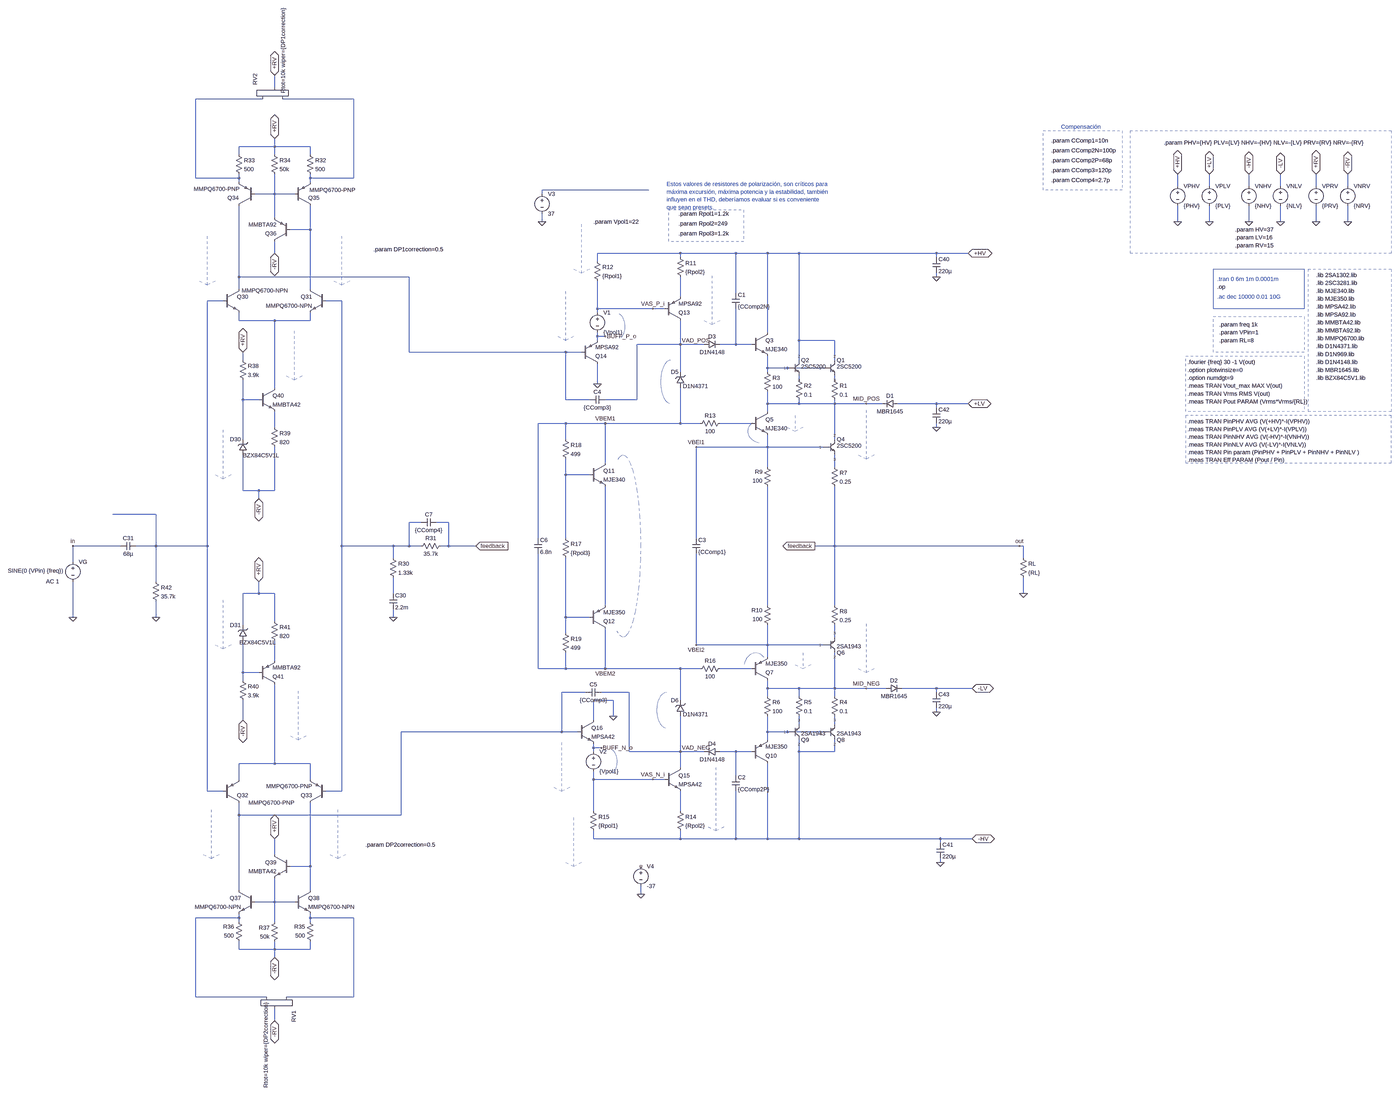
[diagram p0: schematic amplifier_V0.6_Test5.asc, whole sheet]
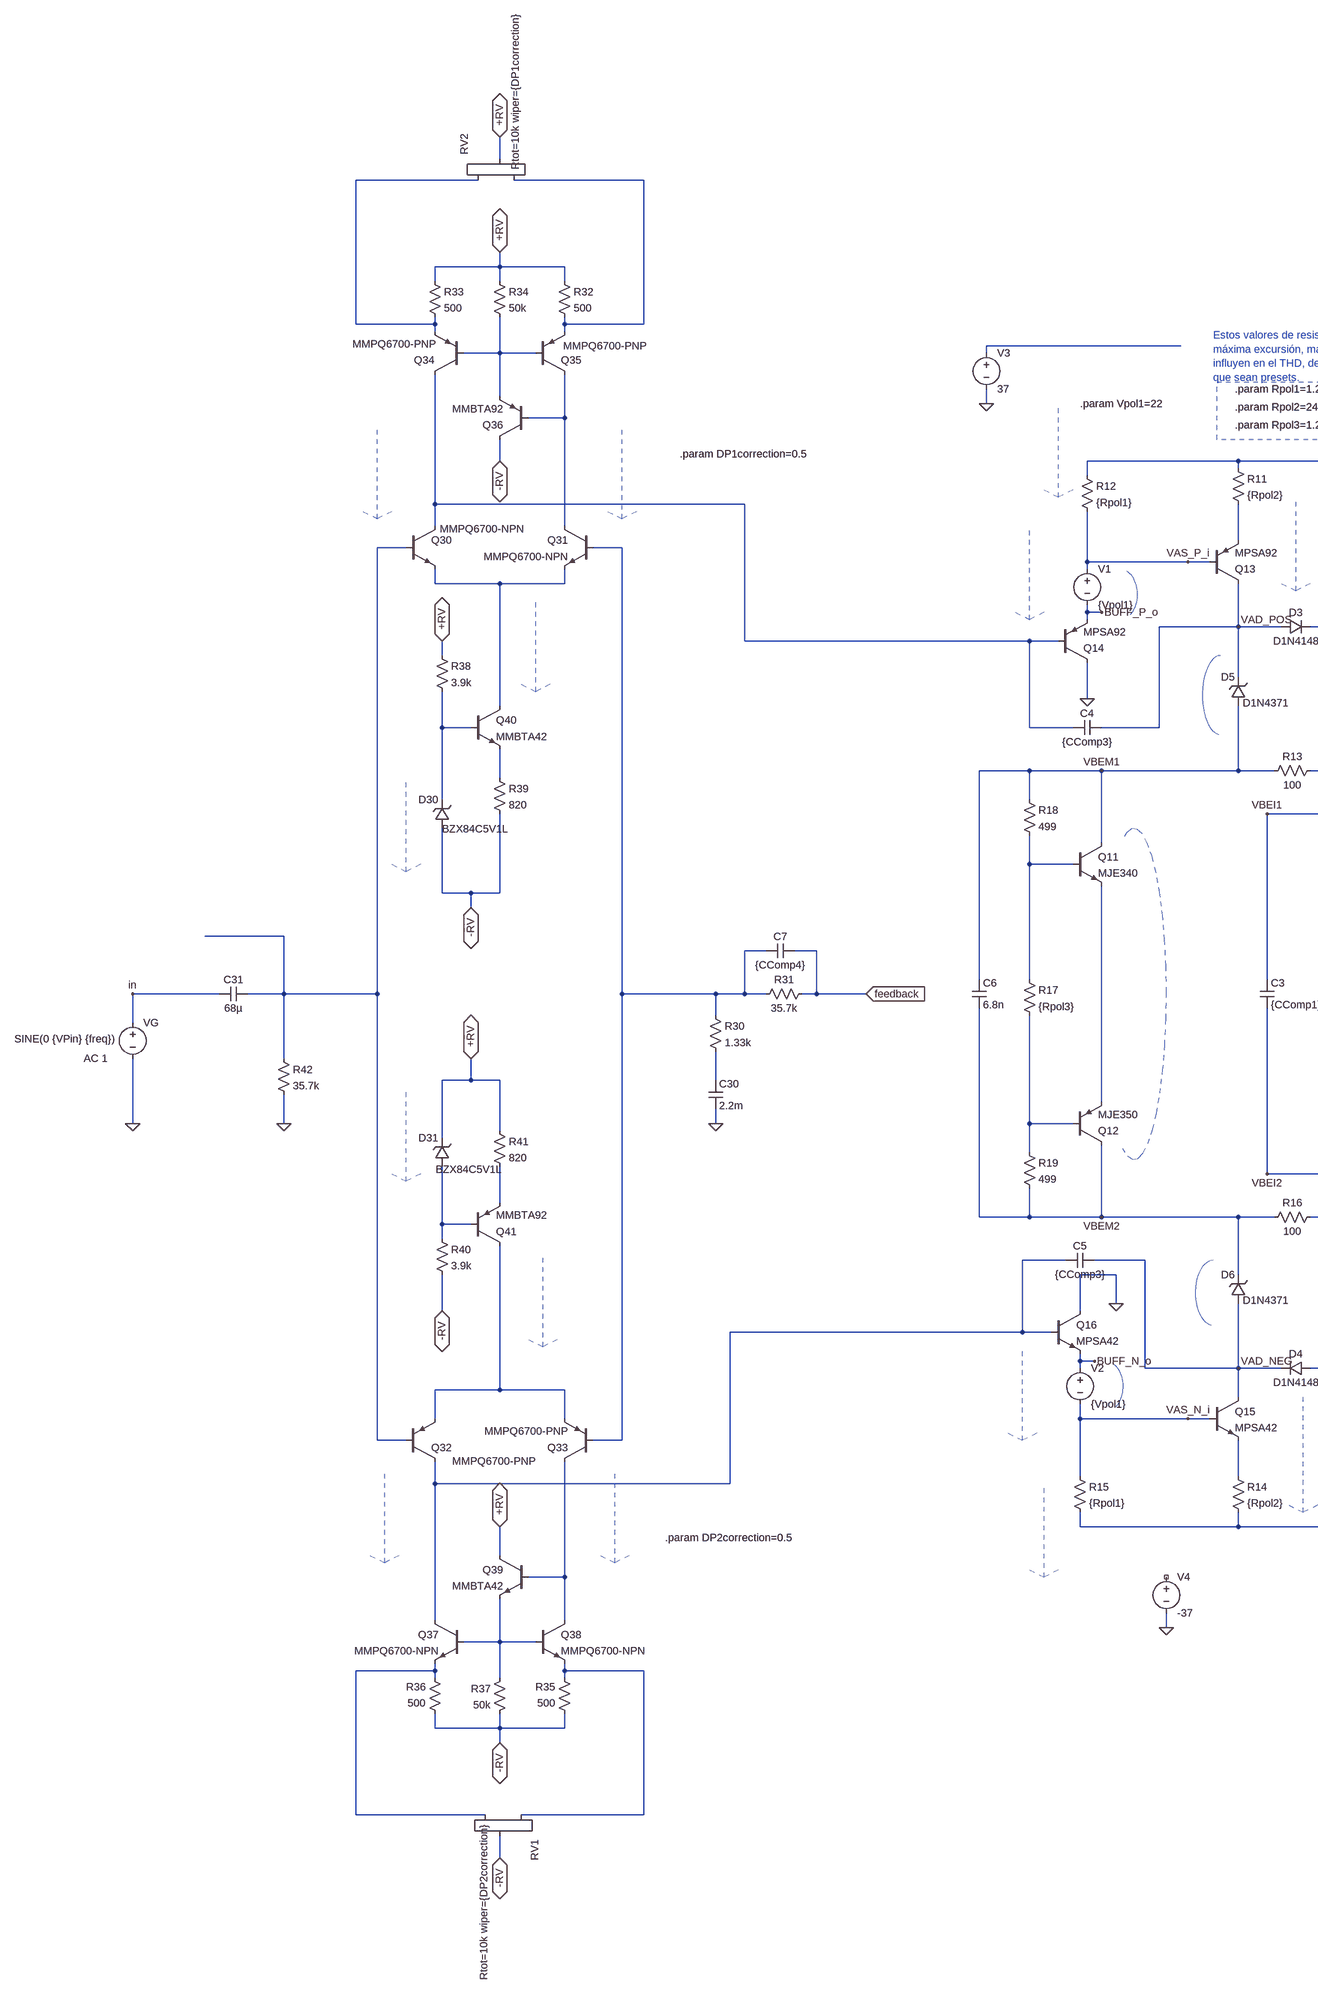
[diagram p1: schematic amplifier_V0.6_Test5.asc, part, row 1 of 1, column 1 of 2]
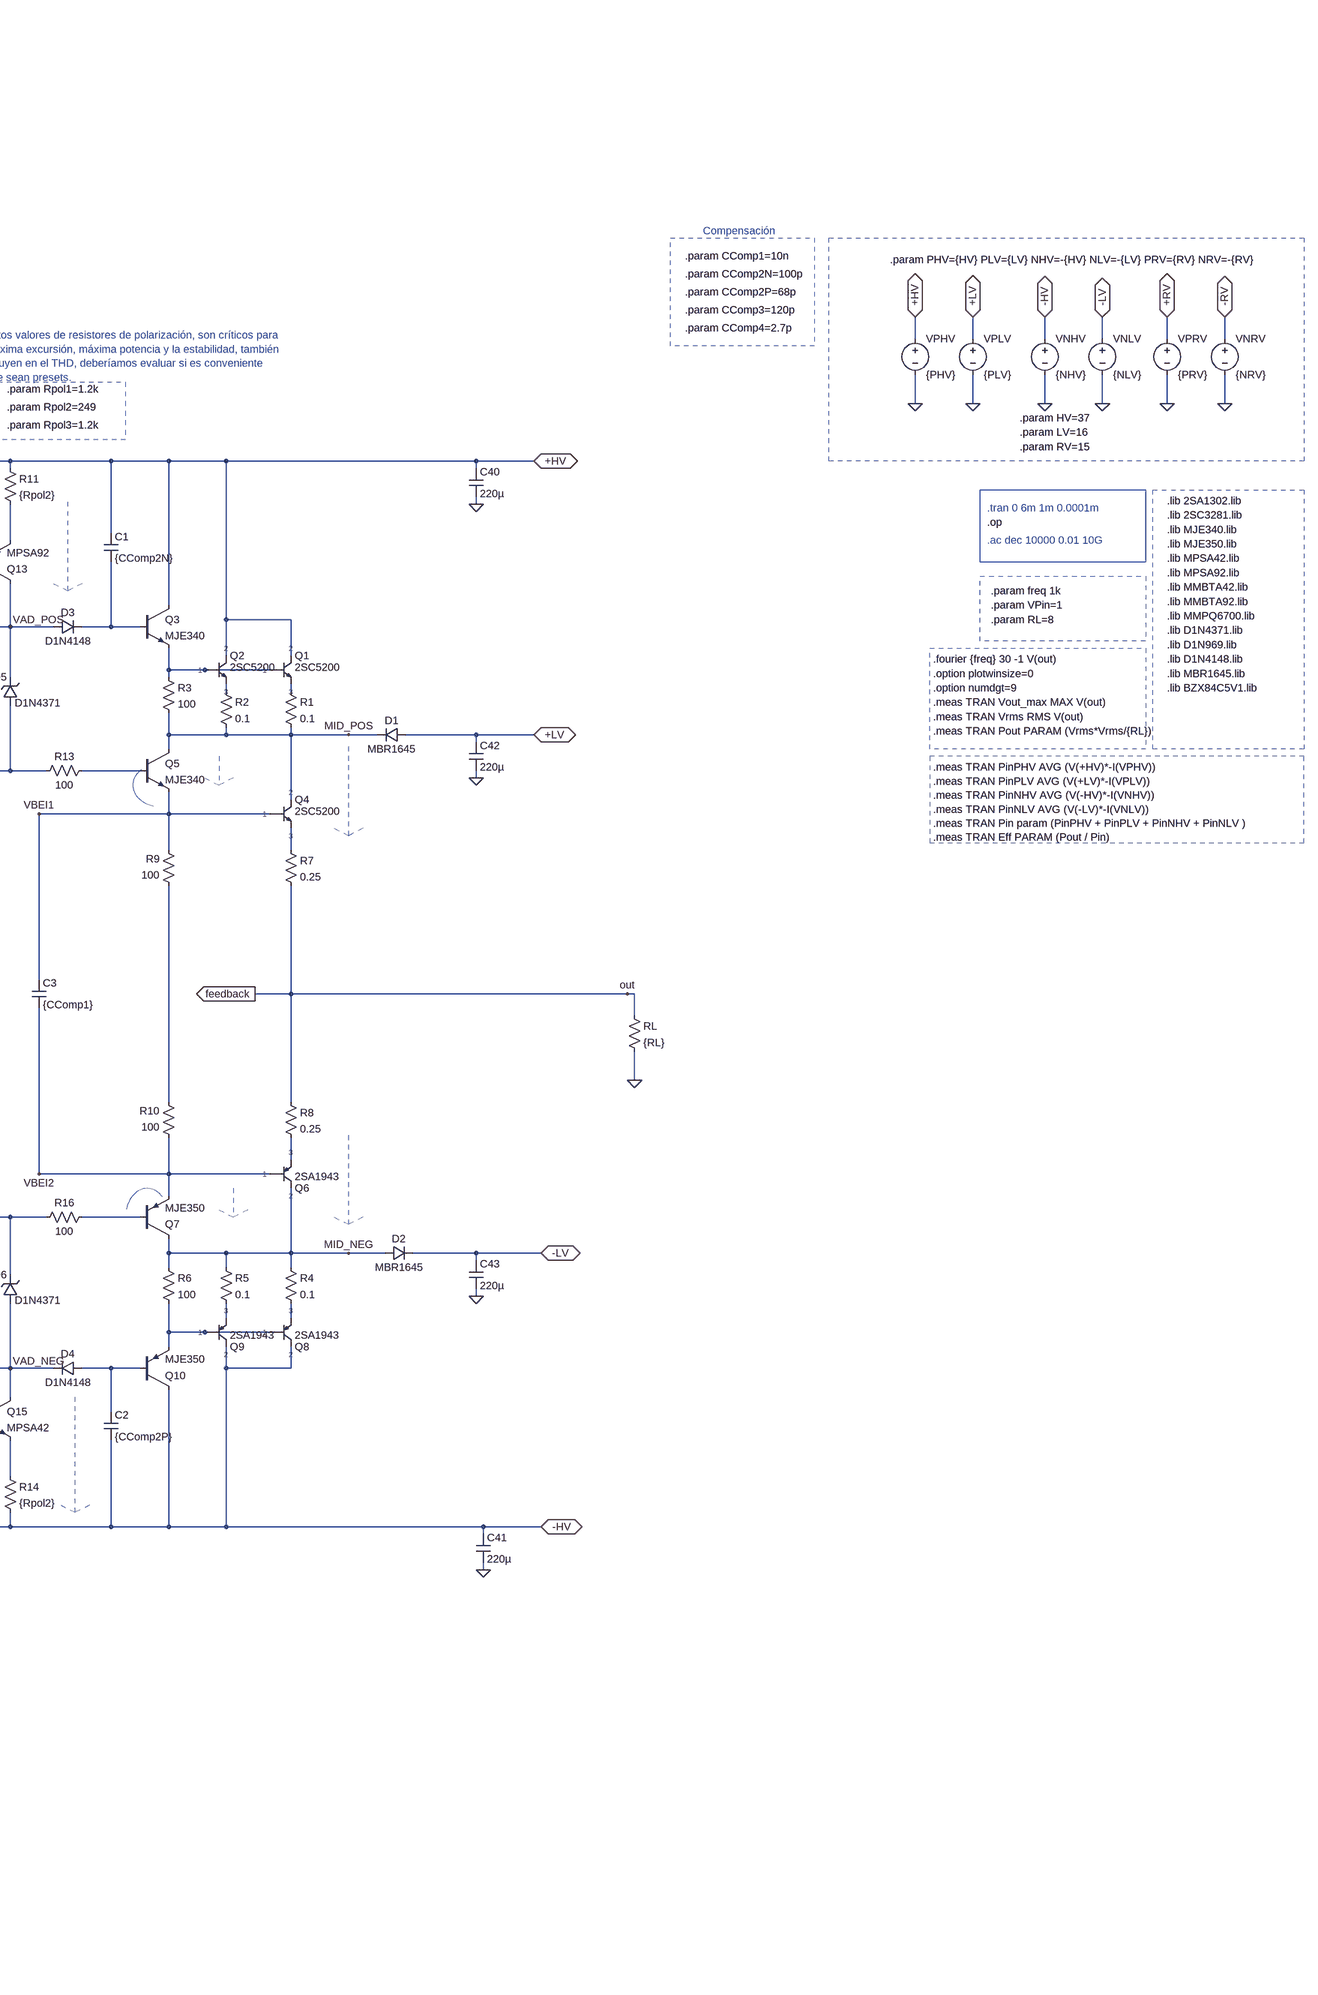
[diagram p2: schematic amplifier_V0.6_Test5.asc, part, row 1 of 1, column 2 of 2]
amplifier_V0.6_Test5.asc, the LTspice schematic file:
Version 4
SHEET 1 4212 2340
WIRE -2016 -1728 -2016 -1776
WIRE -2064 -1680 -2336 -1680
WIRE -1696 -1680 -1984 -1680
WIRE -2016 -1488 -2016 -1520
WIRE -2016 -1488 -2160 -1488
WIRE -1872 -1488 -2016 -1488
WIRE -2160 -1456 -2160 -1488
WIRE -2016 -1456 -2016 -1488
WIRE -1872 -1456 -1872 -1488
WIRE -2336 -1360 -2336 -1680
WIRE -2160 -1360 -2160 -1376
WIRE -2160 -1360 -2336 -1360
WIRE -1872 -1360 -1872 -1376
WIRE -1696 -1360 -1696 -1680
WIRE -1696 -1360 -1872 -1360
WIRE -2160 -1344 -2160 -1360
WIRE -1872 -1344 -1872 -1360
WIRE 1936 -1328 1936 -1376
WIRE 2064 -1328 2064 -1376
WIRE 2224 -1328 2224 -1376
WIRE 2352 -1328 2352 -1376
WIRE 2496 -1328 2496 -1376
WIRE 2624 -1328 2624 -1376
WIRE -432 -1312 -864 -1312
WIRE -2016 -1296 -2016 -1376
WIRE -2016 -1296 -2096 -1296
WIRE -1936 -1296 -2016 -1296
WIRE -864 -1296 -864 -1312
WIRE -2016 -1200 -2016 -1296
WIRE -864 -1184 -864 -1216
WIRE 1936 -1184 1936 -1248
WIRE 2064 -1184 2064 -1248
WIRE 2224 -1184 2224 -1248
WIRE 2352 -1184 2352 -1248
WIRE 2496 -1184 2496 -1248
WIRE 2624 -1184 2624 -1248
WIRE -1872 -1152 -1872 -1248
WIRE -1872 -1152 -1952 -1152
WIRE -2016 -1056 -2016 -1104
WIRE -304 -1056 -640 -1056
WIRE -80 -1056 -304 -1056
WIRE 48 -1056 -80 -1056
WIRE 176 -1056 48 -1056
WIRE 960 -1056 176 -1056
WIRE 1088 -1056 960 -1056
WIRE -304 -1040 -304 -1056
WIRE 960 -1040 960 -1056
WIRE -640 -1024 -640 -1056
WIRE -2160 -960 -2160 -1248
WIRE -1472 -960 -2160 -960
WIRE 960 -960 960 -976
WIRE -2160 -912 -2160 -960
WIRE -1872 -912 -1872 -1152
WIRE -80 -896 -80 -1056
WIRE -304 -880 -304 -960
WIRE -2224 -864 -2288 -864
WIRE -1744 -864 -1808 -864
WIRE -640 -832 -640 -944
WIRE -416 -832 -640 -832
WIRE -368 -832 -416 -832
WIRE -640 -816 -640 -832
WIRE -2160 -784 -2160 -816
WIRE -2016 -784 -2160 -784
WIRE -1872 -784 -1872 -816
WIRE -1872 -784 -2016 -784
WIRE 48 -736 48 -1056
WIRE -640 -720 -640 -736
WIRE -608 -720 -640 -720
WIRE -640 -704 -640 -720
WIRE 176 -704 176 -1056
WIRE 320 -704 176 -704
WIRE -304 -688 -304 -784
WIRE -304 -688 -480 -688
WIRE -208 -688 -304 -688
WIRE -80 -688 -80 -832
WIRE -80 -688 -144 -688
WIRE -16 -688 -80 -688
WIRE -1472 -656 -1472 -960
WIRE -768 -656 -1472 -656
WIRE -704 -656 -768 -656
WIRE -2144 -624 -2144 -656
WIRE 176 -624 176 -704
WIRE 320 -624 320 -704
WIRE 48 -592 48 -640
WIRE 128 -592 48 -592
WIRE 272 -592 128 -592
WIRE -304 -576 -304 -688
WIRE 48 -576 48 -592
WIRE 176 -544 176 -560
WIRE 320 -544 320 -560
WIRE -640 -528 -640 -608
WIRE -2016 -512 -2016 -784
WIRE -2144 -464 -2144 -544
WIRE -2080 -464 -2144 -464
WIRE -768 -464 -768 -656
WIRE -672 -464 -768 -464
WIRE -480 -464 -480 -688
WIRE -480 -464 -608 -464
WIRE 48 -448 48 -496
WIRE 176 -448 176 -464
WIRE 176 -448 48 -448
WIRE 320 -448 320 -464
WIRE 320 -448 176 -448
WIRE 448 -448 320 -448
WIRE 512 -448 448 -448
WIRE 960 -448 576 -448
WIRE 1088 -448 960 -448
WIRE 960 -432 960 -448
WIRE 48 -416 48 -448
WIRE -768 -368 -880 -368
WIRE -608 -368 -768 -368
WIRE -304 -368 -304 -512
WIRE -304 -368 -608 -368
WIRE -224 -368 -304 -368
WIRE -16 -368 -144 -368
WIRE -2016 -352 -2016 -416
WIRE 960 -352 960 -368
WIRE -2144 -304 -2144 -464
WIRE -768 -304 -768 -368
WIRE 320 -304 320 -448
WIRE 48 -272 48 -320
WIRE 48 -272 -240 -272
WIRE 272 -272 48 -272
WIRE -608 -208 -608 -368
WIRE 48 -192 48 -272
WIRE 320 -192 320 -240
WIRE -768 -160 -768 -224
WIRE -672 -160 -768 -160
WIRE -2144 -96 -2144 -240
WIRE -2080 -96 -2144 -96
WIRE -2016 -96 -2016 -272
WIRE -2016 -96 -2080 -96
WIRE -2080 -64 -2080 -96
WIRE -2496 0 -2672 0
WIRE -1424 32 -1472 32
WIRE -1312 32 -1360 32
WIRE -880 96 -880 -368
WIRE -768 96 -768 -160
WIRE -240 96 -240 -272
WIRE -2640 128 -2912 128
WIRE -2496 128 -2496 0
WIRE -2496 128 -2576 128
WIRE -2288 128 -2288 -864
WIRE -2288 128 -2496 128
WIRE -1744 128 -1744 -864
WIRE -1536 128 -1744 128
WIRE -1472 128 -1472 32
WIRE -1472 128 -1536 128
WIRE -1424 128 -1472 128
WIRE -1312 128 -1312 32
WIRE -1312 128 -1344 128
WIRE -1152 128 -1312 128
WIRE 320 128 320 -112
WIRE 320 128 240 128
WIRE 1296 128 320 128
WIRE 1312 128 1296 128
WIRE -1536 176 -1536 128
WIRE 1312 176 1312 128
WIRE -2912 192 -2912 128
WIRE -2496 272 -2496 128
WIRE -2080 320 -2080 272
WIRE -2080 320 -2144 320
WIRE -2016 320 -2080 320
WIRE -1536 320 -1536 256
WIRE 1312 320 1312 256
WIRE -608 368 -608 -112
WIRE 48 368 48 -112
WIRE 320 368 320 128
WIRE -2912 416 -2912 272
WIRE -2496 416 -2496 352
WIRE -1536 416 -1536 384
WIRE -768 416 -768 176
WIRE -672 416 -768 416
WIRE -2016 432 -2016 320
WIRE -2144 448 -2144 320
WIRE -768 480 -768 416
WIRE 320 496 320 448
WIRE -240 528 -240 160
WIRE 48 528 48 448
WIRE 48 528 -240 528
WIRE 272 528 48 528
WIRE 48 576 48 528
WIRE -2016 592 -2016 512
WIRE -880 624 -880 160
WIRE -768 624 -768 560
WIRE -768 624 -880 624
WIRE -608 624 -608 464
WIRE -608 624 -768 624
WIRE -304 624 -608 624
WIRE -224 624 -304 624
WIRE -16 624 -144 624
WIRE -2144 640 -2144 512
WIRE -2080 640 -2144 640
WIRE -2144 672 -2144 640
WIRE 48 704 48 672
WIRE 176 704 48 704
WIRE 320 704 320 560
WIRE 320 704 176 704
WIRE 448 704 320 704
WIRE 528 704 448 704
WIRE 960 704 592 704
WIRE 1104 704 960 704
WIRE -688 720 -784 720
WIRE -512 720 -624 720
WIRE 960 720 960 704
WIRE 48 736 48 704
WIRE 176 736 176 704
WIRE 320 736 320 704
WIRE -576 752 -656 752
WIRE -304 752 -304 624
WIRE 960 800 960 784
WIRE -576 816 -576 752
WIRE -2144 832 -2144 752
WIRE -656 832 -656 752
WIRE 176 848 176 816
WIRE 320 848 320 816
WIRE -784 880 -784 720
WIRE -784 880 -1504 880
WIRE -720 880 -784 880
WIRE 48 880 48 816
WIRE 128 880 48 880
WIRE 272 880 128 880
WIRE 48 912 48 880
WIRE -656 944 -656 928
WIRE -624 944 -656 944
WIRE -656 960 -656 944
WIRE -512 960 -512 720
WIRE -304 960 -304 816
WIRE -304 960 -512 960
WIRE -208 960 -304 960
WIRE -80 960 -144 960
WIRE -16 960 -80 960
WIRE 176 960 176 912
WIRE 320 960 320 912
WIRE 320 960 176 960
WIRE -2016 1008 -2016 688
WIRE -2016 1008 -2160 1008
WIRE -1872 1008 -2016 1008
WIRE -304 1024 -304 960
WIRE -80 1056 -80 960
WIRE -2160 1072 -2160 1008
WIRE -1872 1072 -1872 1008
WIRE -656 1072 -656 1040
WIRE -416 1072 -656 1072
WIRE -368 1072 -416 1072
WIRE -2288 1120 -2288 128
WIRE -2224 1120 -2288 1120
WIRE -1744 1120 -1744 128
WIRE -1744 1120 -1808 1120
WIRE -656 1200 -656 1072
WIRE -304 1200 -304 1120
WIRE -2160 1216 -2160 1168
WIRE -1504 1216 -1504 880
WIRE -1504 1216 -2160 1216
WIRE -656 1312 -656 1280
WIRE -304 1312 -304 1280
WIRE -304 1312 -656 1312
WIRE -80 1312 -80 1120
WIRE -80 1312 -304 1312
WIRE 48 1312 48 1008
WIRE 48 1312 -80 1312
WIRE 176 1312 176 960
WIRE 176 1312 48 1312
WIRE 976 1312 176 1312
WIRE 1104 1312 976 1312
WIRE 976 1328 976 1312
WIRE -2016 1376 -2016 1312
WIRE 976 1408 976 1392
WIRE -1872 1424 -1872 1168
WIRE -1872 1424 -1952 1424
WIRE -2160 1520 -2160 1216
WIRE -1872 1520 -1872 1424
WIRE -464 1536 -464 1504
WIRE -2016 1568 -2016 1472
WIRE -2016 1568 -2096 1568
WIRE -1936 1568 -2016 1568
WIRE -2160 1632 -2160 1616
WIRE -2160 1632 -2336 1632
WIRE -1872 1632 -1872 1616
WIRE -1696 1632 -1872 1632
WIRE -2160 1648 -2160 1632
WIRE -2016 1648 -2016 1568
WIRE -1872 1648 -1872 1632
WIRE -2160 1760 -2160 1728
WIRE -2016 1760 -2016 1728
WIRE -2016 1760 -2160 1760
WIRE -1872 1760 -1872 1728
WIRE -1872 1760 -2016 1760
WIRE -2016 1792 -2016 1760
WIRE -2336 1952 -2336 1632
WIRE -2048 1952 -2336 1952
WIRE -1696 1952 -1696 1632
WIRE -1696 1952 -1968 1952
WIRE -2016 2048 -2016 2000
FLAG -608 -368 VBEM1
FLAG -608 624 VBEM2
FLAG -304 -688 VAD_POS
FLAG -304 960 VAD_NEG
FLAG 448 704 MID_NEG
FLAG 448 -448 MID_POS
FLAG -240 -272 VBEI1
FLAG -240 528 VBEI2
FLAG -2496 416 0
FLAG -1536 416 0
FLAG -640 -528 0
FLAG -576 816 0
FLAG -2016 -1520 +RV
IOPIN -2016 -1520 BiDir
FLAG -2016 1792 -RV
IOPIN -2016 1792 BiDir
FLAG -2016 1312 +RV
IOPIN -2016 1312 BiDir
FLAG -2016 -1056 -RV
IOPIN -2016 -1056 BiDir
FLAG -2144 -656 +RV
IOPIN -2144 -656 BiDir
FLAG -2080 -64 -RV
IOPIN -2080 -64 BiDir
FLAG -2080 272 +RV
IOPIN -2080 272 BiDir
FLAG -2144 832 -RV
IOPIN -2144 832 BiDir
FLAG 1104 1312 -HV
IOPIN 1104 1312 BiDir
FLAG 1104 704 -LV
IOPIN 1104 704 BiDir
FLAG 1088 -1056 +HV
IOPIN 1088 -1056 BiDir
FLAG 1088 -448 +LV
IOPIN 1088 -448 BiDir
FLAG 1312 320 0
FLAG 1296 128 out
FLAG -1152 128 feedback
IOPIN -1152 128 In
FLAG 240 128 feedback
IOPIN 240 128 Out
FLAG -2912 416 0
FLAG -2912 128 in
FLAG -416 -832 VAS_P_i
FLAG -608 -720 BUFF_P_o
FLAG -416 1072 VAS_N_i
FLAG -624 944 BUFF_N_o
FLAG 960 -960 0
FLAG 960 -352 0
FLAG 960 800 0
FLAG 976 1408 0
FLAG -2016 -1776 +RV
IOPIN -2016 -1776 BiDir
FLAG -2016 2048 -RV
IOPIN -2016 2048 BiDir
FLAG 1936 -1184 0
FLAG 2064 -1184 0
FLAG 2224 -1184 0
FLAG 2352 -1184 0
FLAG 1936 -1376 +HV
IOPIN 1936 -1376 BiDir
FLAG 2064 -1376 +LV
IOPIN 2064 -1376 BiDir
FLAG 2224 -1376 -HV
IOPIN 2224 -1376 BiDir
FLAG 2352 -1376 -LV
IOPIN 2352 -1376 BiDir
FLAG 2496 -1184 0
FLAG 2624 -1184 0
FLAG 2496 -1376 +RV
IOPIN 2496 -1376 BiDir
FLAG 2624 -1376 -RV
IOPIN 2624 -1376 BiDir
FLAG -864 -1184 0
FLAG -464 1536 0
DATAFLAG 96 704 "round($*100)/100"
DATAFLAG 448 -304 "Ix(q4:2)"
DATAFLAG 448 560 "-Ix(q6:2)"
DATAFLAG -464 128 "V(vbem1)-V(vbem2)"
DATAFLAG 160 -368 "-Ie(Q5)"
DATAFLAG 192 592 "Ie(Q7)"
DATAFLAG -608 -288 "-Ic(Q13)"
DATAFLAG -608 544 "Ic(Q12)"
DATAFLAG -384 -496 "V(vad_pos)-V(vbem1)"
DATAFLAG -400 784 "-(V(vad_neg)-V(vbem2))"
DATAFLAG -16 -304 "V(vbem1)-V(vbei1)"
DATAFLAG -32 576 "-(V(vbem2)-V(vbei2))"
DATAFLAG -448 624 ""
DATAFLAG -464 -368 ""
DATAFLAG -176 -864 "-Ic(Q13)"
DATAFLAG -160 1136 "Ic(Q15)"
DATAFLAG -768 -800 "Ie(Q14)"
DATAFLAG -528 1072 ""
DATAFLAG -944 -656 ""
DATAFLAG -1008 880 ""
DATAFLAG -416 -688 ""
DATAFLAG -1744 -1024 "Ic(Q31)"
DATAFLAG -2288 -1024 "Ic(Q30)"
DATAFLAG -2016 -784 ""
DATAFLAG -2272 1296 "-Ic(Q32)"
DATAFLAG -2016 1008 ""
DATAFLAG -2160 1328 ""
DATAFLAG -1760 1296 "-Ic(Q33)"
DATAFLAG -1872 1344 ""
DATAFLAG -2160 -1040 ""
DATAFLAG -1872 -1040 ""
DATAFLAG -2000 -1296 ""
DATAFLAG 1200 128 ""
DATAFLAG -2144 -480 ""
DATAFLAG -2016 -400 ""
DATAFLAG -528 -832 ""
DATAFLAG 48 144 ""
DATAFLAG -1584 128 ""
DATAFLAG -560 1008 "V(VAS_P_i)-V(BUFF_P_o)"
DATAFLAG -528 -768 "V(VAS_P_i)-V(BUFF_P_o)"
DATAFLAG -1936 -640 "Ic(Q40)"
DATAFLAG -1920 816 "-Ic(Q41)"
DATAFLAG 48 -592 ""
DATAFLAG -304 -928 ""
DATAFLAG -304 1168 ""
DATAFLAG -368 960 ""
DATAFLAG -80 960 ""
DATAFLAG -784 1008 "-Ie(Q16)"
DATAFLAG -608 80 ""
DATAFLAG -2224 -240 "Ix(D30:-)"
DATAFLAG -2224 448 "Ix(D31:-)"
DATAFLAG -2128 640 ""
DATAFLAG -704 -1072 "I(R12)"
DATAFLAG -736 1328 "I(R15)"
DATAFLAG -1248 128 ""
DATAFLAG -2032 320 ""
DATAFLAG -2048 -96 ""
DATAFLAG -1936 -1488 ""
DATAFLAG -2016 -1072 ""
DATAFLAG -496 -1056 ""
DATAFLAG -2144 -640 ""
DATAFLAG -2144 800 ""
DATAFLAG -1968 1760 ""
DATAFLAG -2016 1344 ""
DATAFLAG 208 1312 ""
DATAFLAG -320 1472 "I(V4)"
DATAFLAG -736 -1248 "-I(V3)"
DATAFLAG -2496 128 ""
SYMBOL npn -16 -736 R0
SYMATTR InstName Q3
SYMATTR Value MJE340
SYMBOL res 32 -592 R0
SYMATTR InstName R3
SYMATTR Value 100
SYMBOL diode -208 -672 R270
WINDOW 0 32 32 VTop 2
WINDOW 3 0 32 VBottom 2
SYMATTR InstName D3
SYMATTR Value D1N4148
SYMBOL npn -16 -416 R0
SYMATTR InstName Q5
SYMATTR Value MJE340
SYMBOL res 304 -208 R0
SYMATTR InstName R7
SYMATTR Value 0.25
SYMBOL res 64 -96 R180
WINDOW 0 36 76 Left 2
WINDOW 3 36 40 Left 2
SYMATTR InstName R9
SYMATTR Value 100
SYMBOL res 304 352 R0
SYMATTR InstName R8
SYMATTR Value 0.25
SYMBOL pnp -16 672 M180
SYMATTR InstName Q7
SYMATTR Value MJE350
SYMBOL pnp -16 1008 M180
SYMATTR InstName Q10
SYMATTR Value MJE350
SYMBOL res 32 720 R0
SYMATTR InstName R6
SYMATTR Value 100
SYMBOL diode -144 944 R90
WINDOW 0 0 32 VBottom 2
WINDOW 3 32 32 VTop 2
SYMATTR InstName D4
SYMATTR Value D1N4148
SYMBOL diode 528 720 R270
WINDOW 0 32 32 VTop 2
WINDOW 3 0 32 VBottom 2
SYMATTR InstName D2
SYMATTR Value MBR1645
SYMBOL res 64 464 R180
WINDOW 0 36 76 Left 2
WINDOW 3 36 40 Left 2
SYMATTR InstName R10
SYMATTR Value 100
SYMBOL res 304 720 R0
SYMATTR InstName R4
SYMATTR Value 0.1
SYMBOL res 160 720 R0
SYMATTR InstName R5
SYMATTR Value 0.1
SYMBOL res 160 -560 R0
SYMATTR InstName R2
SYMATTR Value 0.1
SYMBOL res 304 -560 R0
SYMATTR InstName R1
SYMATTR Value 0.1
SYMBOL diode 576 -432 M270
WINDOW 0 32 32 VTop 2
WINDOW 3 0 32 VBottom 2
SYMATTR InstName D1
SYMATTR Value MBR1645
SYMBOL pnp -672 464 M180
SYMATTR InstName Q12
SYMATTR Value MJE350
SYMBOL npn -672 -208 R0
SYMATTR InstName Q11
SYMATTR Value MJE340
SYMBOL res -784 80 R0
SYMATTR InstName R17
SYMATTR Value {Rpol3}
SYMBOL res -784 -320 R0
SYMATTR InstName R18
SYMATTR Value 499
SYMBOL res -784 464 R0
SYMATTR InstName R19
SYMATTR Value 499
SYMBOL cap -256 96 R0
SYMATTR InstName C3
SYMATTR Value {CComp1}
SYMBOL res -128 -384 R90
WINDOW 0 0 56 VBottom 2
WINDOW 3 32 56 VTop 2
SYMATTR InstName R13
SYMATTR Value 100
SYMBOL res -128 608 R90
WINDOW 0 0 56 VBottom 2
WINDOW 3 32 56 VTop 2
SYMATTR InstName R16
SYMATTR Value 100
SYMBOL pnp -368 -784 M180
SYMATTR InstName Q13
SYMATTR Value MPSA92
SYMBOL npn -368 1024 R0
SYMATTR InstName Q15
SYMATTR Value MPSA42
SYMBOL cap -896 96 R0
SYMATTR InstName C6
SYMATTR Value 6.8n
SYMBOL npn -720 832 R0
SYMATTR InstName Q16
SYMATTR Value MPSA42
SYMBOL res -1552 160 R0
SYMATTR InstName R30
SYMATTR Value 1.33k
SYMBOL res -1328 112 R90
WINDOW 0 0 56 VBottom 2
WINDOW 3 32 56 VTop 2
SYMATTR InstName R31
SYMATTR Value 35.7k
SYMBOL res -2512 256 R0
SYMATTR InstName R42
SYMATTR Value 35.7k
SYMBOL cap -1552 320 R0
SYMATTR InstName C30
SYMATTR Value 2.2m
SYMBOL cap -2576 112 R90
WINDOW 0 0 32 VBottom 2
WINDOW 3 32 32 VTop 2
SYMATTR InstName C31
SYMATTR Value 68µ
SYMBOL pnp -704 -608 M180
SYMATTR InstName Q14
SYMATTR Value MPSA92
SYMBOL npn -2224 -912 R0
WINDOW 3 75 7 Left 2
SYMATTR Value MMPQ6700-NPN
SYMATTR InstName Q30
SYMBOL npn -1808 -912 M0
SYMATTR InstName Q31
SYMATTR Value MMPQ6700-NPN
SYMBOL pnp -2224 1168 M180
WINDOW 3 102 2 Left 2
SYMATTR Value MMPQ6700-PNP
SYMATTR InstName Q32
SYMBOL pnp -1808 1168 R180
SYMATTR InstName Q33
SYMATTR Value MMPQ6700-PNP
SYMBOL cap -608 -480 R90
WINDOW 0 0 32 VBottom 2
WINDOW 3 32 32 VTop 2
SYMATTR InstName C4
SYMATTR Value {CComp3}
SYMBOL cap -624 704 R90
WINDOW 0 0 32 VBottom 2
WINDOW 3 32 32 VTop 2
SYMATTR InstName C5
SYMATTR Value {CComp3}
SYMBOL pnp -1936 -1248 M180
WINDOW 3 61 64 Left 2
SYMATTR Value MMPQ6700-PNP
SYMATTR InstName Q35
SYMBOL pnp -2096 -1248 R180
WINDOW 0 65 32 Left 2
WINDOW 3 61 68 Left 2
SYMATTR InstName Q34
SYMATTR Value MMPQ6700-PNP
SYMBOL npn -2096 1520 M0
SYMATTR InstName Q37
SYMATTR Value MMPQ6700-NPN
SYMBOL npn -1936 1520 R0
SYMATTR InstName Q38
SYMATTR Value MMPQ6700-NPN
SYMBOL res -320 -1056 R0
SYMATTR InstName R11
SYMATTR Value {Rpol2}
SYMBOL res -320 1184 R0
SYMATTR InstName R14
SYMATTR Value {Rpol2}
SYMBOL res -2176 -1472 R0
SYMATTR InstName R33
SYMATTR Value 500
SYMBOL res -1888 -1472 R0
SYMATTR InstName R32
SYMATTR Value 500
SYMBOL res -1856 1744 R180
WINDOW 0 36 76 Left 2
WINDOW 3 36 40 Left 2
SYMATTR InstName R35
SYMATTR Value 500
SYMBOL res -2144 1744 R180
WINDOW 0 36 76 Left 2
WINDOW 3 36 40 Left 2
SYMATTR InstName R36
SYMATTR Value 500
SYMBOL npn -1952 1376 M0
SYMATTR InstName Q39
SYMATTR Value MMBTA42
SYMBOL pnp -1952 -1104 R180
SYMATTR InstName Q36
SYMATTR Value MMBTA92
SYMBOL res -2000 1632 M0
SYMATTR InstName R37
SYMATTR Value 50k
SYMBOL res -2032 -1472 R0
SYMATTR InstName R34
SYMATTR Value 50k
SYMBOL 2SC5200 144 -608 R0
SYMATTR InstName Q2
SYMBOL 2SC5200 288 -608 R0
SYMATTR InstName Q1
SYMBOL 2SC5200 288 -288 R0
SYMATTR InstName Q4
SYMBOL 2SA1943 288 544 M180
SYMATTR InstName Q6
SYMBOL 2SA1943 144 896 M180
SYMATTR InstName Q9
SYMBOL 2SA1943 288 896 M180
SYMATTR InstName Q8
SYMBOL res -2160 -640 R0
SYMATTR InstName R38
SYMATTR Value 3.9k
SYMBOL npn -2080 -512 R0
SYMATTR InstName Q40
SYMATTR Value MMBTA42
SYMBOL res -2032 -368 R0
SYMATTR InstName R39
SYMATTR Value 820
SYMBOL pnp -2080 688 M180
SYMATTR InstName Q41
SYMATTR Value MMBTA92
SYMBOL res -2032 416 R0
SYMATTR InstName R41
SYMATTR Value 820
SYMBOL res -2160 656 R0
SYMATTR InstName R40
SYMATTR Value 3.9k
SYMBOL res 1296 160 R0
SYMATTR InstName RL
SYMATTR Value {RL}
SYMBOL cap -96 1056 R0
SYMATTR InstName C2
SYMATTR Value {CComp2P}
SYMBOL cap -96 -896 R0
SYMATTR InstName C1
SYMATTR Value {CComp2N}
SYMBOL voltage -2912 176 R0
WINDOW 3 -263 52 Left 2
WINDOW 123 -109 95 Left 2
WINDOW 39 0 0 Left 2
SYMATTR Value SINE(0 {VPin} {freq})
SYMATTR Value2 AC 1
SYMATTR InstName VG
SYMBOL zener -288 -512 R180
WINDOW 0 24 64 Left 2
WINDOW 3 -96 7 Left 2
SYMATTR InstName D5
SYMATTR Value D1N4371
SYMBOL zener -288 816 R180
WINDOW 0 24 64 Left 2
WINDOW 3 -96 7 Left 2
SYMATTR InstName D6
SYMATTR Value D1N4371
SYMBOL cap 944 -1040 R0
SYMATTR InstName C40
SYMATTR Value 220µ
SYMBOL cap 944 -432 R0
SYMATTR InstName C42
SYMATTR Value 220µ
SYMBOL cap 944 720 R0
SYMATTR InstName C43
SYMATTR Value 220µ
SYMBOL cap 960 1328 R0
SYMATTR InstName C41
SYMATTR Value 220µ
SYMBOL zener -2128 -240 R180
WINDOW 0 24 64 Left 2
WINDOW 3 -131 -1 Left 2
SYMATTR InstName D30
SYMATTR Value BZX84C5V1L
SYMATTR Prefix X
SYMBOL zener -2128 512 R180
WINDOW 0 24 64 Left 2
WINDOW 3 -117 -6 Left 2
SYMATTR InstName D31
SYMATTR Value BZX84C5V1L
SYMATTR Prefix X
SYMBOL potentiometer_standard -1952 1936 R90
WINDOW 3 39 99 Left 2
SYMATTR Value Rtot=10k wiper={DP2correction}
SYMATTR InstName RV1
SYMATTR SpiceLine ""
SYMBOL potentiometer_standard -2080 -1664 R270
WINDOW 3 39 99 Left 2
SYMATTR Value Rtot=10k wiper={DP1correction}
SYMATTR InstName RV2
SYMATTR SpiceLine ""
SYMBOL cap -1360 16 R90
WINDOW 0 0 32 VBottom 2
WINDOW 3 32 32 VTop 2
SYMATTR InstName C7
SYMATTR Value {CComp4}
SYMBOL voltage 1936 -1344 R0
SYMATTR InstName VPHV
SYMATTR Value {PHV}
SYMBOL voltage 2064 -1344 R0
SYMATTR InstName VPLV
SYMATTR Value {PLV}
SYMBOL voltage 2224 -1344 R0
SYMATTR InstName VNHV
SYMATTR Value {NHV}
SYMBOL voltage 2352 -1344 R0
SYMATTR InstName VNLV
SYMATTR Value {NLV}
SYMBOL voltage 2496 -1344 R0
SYMATTR InstName VPRV
SYMATTR Value {PRV}
SYMBOL voltage 2624 -1344 R0
SYMATTR InstName VNRV
SYMATTR Value {NRV}
SYMBOL voltage -640 -832 R0
WINDOW 123 0 0 Left 0
WINDOW 39 0 0 Left 0
SYMATTR InstName V1
SYMATTR Value {Vpol1}
SYMBOL voltage -656 944 R0
SYMATTR InstName V2
SYMATTR Value {Vpol1}
SYMBOL voltage -864 -1312 R0
WINDOW 123 0 0 Left 0
WINDOW 39 0 0 Left 0
SYMATTR InstName V3
SYMATTR Value 37
SYMBOL voltage -464 1408 R0
WINDOW 123 0 0 Left 0
WINDOW 39 0 0 Left 0
SYMATTR InstName V4
SYMATTR Value -37
SYMBOL res -656 -1040 R0
SYMATTR InstName R12
SYMATTR Value {Rpol1}
SYMBOL res -672 1184 R0
SYMATTR InstName R15
SYMATTR Value {Rpol1}
TEXT 2096 -952 Left 2 ;.tran 0 6m 1m 0.0001m
TEXT 2104 -768 Left 2 !.param freq 1k
TEXT 2096 -920 Left 2 !.op
TEXT 1976 -616 Left 2 !.fourier {freq} 30 -1 V(out)
TEXT 2496 -968 Left 2 !.lib 2SA1302.lib
TEXT 2496 -936 Left 2 !.lib 2SC3281.lib
TEXT 2496 -680 Left 2 !.lib D1N4371.lib
TEXT 2496 -584 Left 2 !.lib MBR1645.lib
TEXT 2496 -904 Left 2 !.lib MJE340.lib
TEXT 2496 -872 Left 2 !.lib MJE350.lib
TEXT 2496 -616 Left 2 !.lib D1N4148.lib
TEXT 2496 -840 Left 2 !.lib MPSA42.lib
TEXT 2496 -808 Left 2 !.lib MPSA92.lib
TEXT 2496 -648 Left 2 !.lib D1N969.lib
TEXT 2096 -880 Left 2 ;.ac dec 10000 0.01 10G
TEXT 2104 -736 Left 2 !.param VPin=1
TEXT 2496 -552 Left 2 !.lib BZX84C5V1.lib
TEXT 2496 -776 Left 2 !.lib MMBTA42.lib
TEXT 2496 -744 Left 2 !.lib MMBTA92.lib
TEXT 2496 -712 Left 2 !.lib MMPQ6700.lib
TEXT 1976 -584 Left 2 !.option plotwinsize=0
TEXT 1976 -488 Left 2 !.meas TRAN Vrms RMS V(out)
TEXT 1976 -456 Left 2 !.meas TRAN Pout PARAM (Vrms*Vrms/{RL})
TEXT 1976 -552 Left 2 !.option numdgt=9
TEXT 1976 -520 Left 2 !.meas TRAN Vout_max MAX V(out)
TEXT 2104 -704 Left 2 !.param RL=8
TEXT 1976 -376 Left 2 !.meas TRAN PinPHV AVG (V(+HV)*-I(VPHV))\n.meas TRAN PinPLV AVG (V(+LV)*-I(VPLV))\n.meas TRAN PinNHV AVG (V(-HV)*-I(VNHV))\n.meas TRAN PinNLV AVG (V(-LV)*-I(VNLV))\n.meas TRAN Pin param (PinPHV + PinPLV + PinNHV + PinNLV )\n.meas TRAN Eff PARAM (Pout / Pin)
TEXT -312 -1216 Left 2 !.param Rpol1=1.2k
TEXT -312 -1176 Left 2 !.param Rpol2=249
TEXT -312 -1136 Left 2 !.param Rpol3=1.2k
TEXT -360 -1336 Left 2 ;Estos valores de resistores de polarización, son críticos para\nmáxima excursión, máxima potencia y la estabilidad, también\ninfluyen en el THD, deberíamos evaluar si es conveniente\nque sean presets.
TEXT 1424 -1512 Left 2 !.param CComp1=10n
TEXT 1424 -1472 Left 2 !.param CComp2N=100p
TEXT 1424 -1392 Left 2 !.param CComp3=120p
TEXT 1464 -1568 Left 2 ;Compensación
TEXT 1424 -1432 Left 2 !.param CComp2P=68p
TEXT 1424 -1352 Left 2 !.param CComp4=2.7p
TEXT 1880 -1504 Left 2 !.param PHV={HV} PLV={LV} NHV=-{HV} NLV=-{LV} PRV={RV} NRV=-{RV}
TEXT 2168 -1152 Left 2 !.param HV=37
TEXT 2168 -1120 Left 2 !.param LV=16
TEXT 2168 -1088 Left 2 !.param RV=15
TEXT -1616 -1072 Left 2 !.param DP1correction=0.5
TEXT -1648 1336 Left 2 !.param DP2correction=0.5
TEXT -656 -1184 Left 2 !.param Vpol1=22
LINE Normal -768 -704 -768 -912 2
LINE Normal 448 -224 448 -432 2
LINE Normal 480 -240 448 -224 2
LINE Normal 416 -240 448 -224 2
LINE Normal 448 640 448 432 2
LINE Normal 480 624 448 640 2
LINE Normal 416 624 448 640 2
LINE Normal -144 -784 -176 -768 2
LINE Normal -208 -784 -176 -768 2
LINE Normal -160 1280 -160 1024 2
LINE Normal 192 -352 160 -336 2
LINE Normal 128 -352 160 -336 2
LINE Normal 160 -400 160 -336 2
LINE Normal 224 608 192 624 2
LINE Normal 160 608 192 624 2
LINE Normal 192 560 192 624 2
LINE Normal -1744 -928 -1744 -1136 2
LINE Normal -1712 -944 -1744 -928 2
LINE Normal -1776 -944 -1744 -928 2
LINE Normal -2288 -928 -2288 -1136 2
LINE Normal -2256 -944 -2288 -928 2
LINE Normal -2320 -944 -2288 -928 2
LINE Normal -2272 1392 -2272 1184 2
LINE Normal -2240 1376 -2272 1392 2
LINE Normal -2304 1376 -2272 1392 2
LINE Normal -1760 1392 -1760 1184 2
LINE Normal -1728 1376 -1760 1392 2
LINE Normal -1792 1376 -1760 1392 2
LINE Normal -800 -720 -768 -704 2
LINE Normal -736 -720 -768 -704 2
LINE Normal -1936 -544 -1936 -752 2
LINE Normal -1968 -560 -1936 -544 2
LINE Normal -1904 -560 -1936 -544 2
LINE Normal -1920 912 -1920 704 2
LINE Normal -1952 896 -1920 912 2
LINE Normal -1888 896 -1920 912 2
LINE Normal -176 -768 -176 -976 2
LINE Normal -128 1264 -160 1280 2
LINE Normal -192 1264 -160 1280 2
LINE Normal -784 1120 -784 912 2
LINE Normal -752 1104 -784 1120 2
LINE Normal -816 1104 -784 1120 2
LINE Normal -2224 -144 -2224 -352 2
LINE Normal -2256 -160 -2224 -144 2
LINE Normal -2192 -160 -2224 -144 2
LINE Normal -2224 544 -2224 336 2
LINE Normal -2256 528 -2224 544 2
LINE Normal -2192 528 -2224 544 2
LINE Normal -704 -976 -704 -1184 2
LINE Normal -736 -992 -704 -976 2
LINE Normal -672 -992 -704 -976 2
LINE Normal -736 1424 -736 1216 2
LINE Normal -768 1408 -736 1424 2
LINE Normal -704 1408 -736 1424 2
RECTANGLE Normal 2448 -832 2080 -992
RECTANGLE Normal 2448 -656 2080 -800 3
RECTANGLE Normal 2800 -416 2464 -992 2
RECTANGLE Normal 2448 -416 1968 -640 3
RECTANGLE Normal 1968 -208 2800 -400 3
RECTANGLE Normal 2800 -1056 1744 -1552 4
RECTANGLE Normal -48 -1104 -352 -1232 2
RECTANGLE Normal 1712 -1312 1392 -1552 1
ARC Normal -32 -384 96 -288 -29 -382 0 -253 3
ARC Normal 48 560 -48 688 46 563 -83 592 3
ARC Normal -608 -240 -464 496 -563 485 -565 -235 2
ARC Normal -320 720 -400 864 -360 712 -364 870 2
ARC Normal -304 -624 -384 -448 -344 -632 -348 -442 2
ARC Normal -528 -704 -608 -816 -528 -685 -550 -816 2
ARC Normal -560 1056 -640 944 -560 1075 -582 944 2

The netlist it stands for:
* amplifier_V0.6_Test5.asc
Q3 +HV N011 N012 0 MJE340
R3 N012 MID_POS 100
D3 VAD_POS N011 D1N4148
Q5 MID_POS N016 VBEI1 0 MJE340
R7 N018 feedback 0.25
R9 N022 VBEI1 100
R8 feedback N024 0.25
Q7 MID_NEG N026 VBEI2 0 MJE350
Q10 -HV N032 N031 0 MJE350
R6 MID_NEG N031 100
D4 N032 VAD_NEG D1N4148
D2 MID_NEG -LV MBR1645
R10 VBEI2 N022 100
R4 MID_NEG N030 0.1
R5 MID_NEG N029 0.1
R2 N013 MID_POS 0.1
R1 N014 MID_POS 0.1
D1 +LV MID_POS MBR1645
Q12 VBEM2 N023 N021 0 MJE350
Q11 VBEM1 N019 N021 0 MJE340
R17 N019 N023 {Rpol3}
R18 VBEM1 N019 499
R19 N023 VBEM2 499
C3 VBEI1 VBEI2 {CComp1}
R13 N016 VBEM1 100
R16 N026 VBEM2 100
Q13 VAD_POS VAS_P_i N007 0 MPSA92
Q15 VAD_NEG VAS_N_i N034 0 MPSA42
C6 VBEM1 VBEM2 6.8n
Q16 0 N028 BUFF_N_o 0 MPSA42
R30 N009 N020 1.33k
R31 feedback N009 35.7k
R42 N008 0 35.7k
C30 N020 0 2.2m
C31 N008 in 68µ
Q14 0 N006 BUFF_P_o 0 MPSA92
Q30 N006 N008 N010 0 MMPQ6700-NPN
Q31 N005 N009 N010 0 MMPQ6700-NPN
Q32 N028 N008 N033 0 MMPQ6700-PNP
Q33 N035 N009 N033 0 MMPQ6700-PNP
C4 VAD_POS N006 {CComp3}
C5 VAD_NEG N028 {CComp3}
Q35 N005 N004 N002 0 MMPQ6700-PNP
Q34 N006 N004 N001 0 MMPQ6700-PNP
Q37 N028 N036 N037 0 MMPQ6700-NPN
Q38 N035 N036 N038 0 MMPQ6700-NPN
R11 +HV N007 {Rpol2}
R14 N034 -HV {Rpol2}
R33 +RV N001 500
R32 +RV N002 500
R35 -RV N038 500
R36 -RV N037 500
Q39 +RV N035 N036 0 MMBTA42
Q36 -RV N005 N004 0 MMBTA92
R37 N036 -RV 50k
R34 +RV N004 50k
XQ2 +HV N012 N013 2SC5200  ; pins 2 1 3
XQ1 +HV N012 N014 2SC5200  ; pins 2 1 3
XQ4 MID_POS VBEI1 N018 2SC5200  ; pins 2 1 3
XQ6 MID_NEG VBEI2 N024 2SA1943  ; pins 2 1 3
XQ9 -HV N031 N029 2SA1943  ; pins 2 1 3
XQ8 -HV N031 N030 2SA1943  ; pins 2 1 3
R38 +RV N015 3.9k
Q40 N010 N015 N017 0 MMBTA42
R39 N017 -RV 820
Q41 N033 N027 N025 0 MMBTA92
R41 +RV N025 820
R40 N027 -RV 3.9k
RL feedback 0 {RL}
C2 N032 -HV {CComp2P}
C1 +HV N011 {CComp2N}
VG in 0 SINE(0 {VPin} {freq}) AC 1
D5 VBEM1 VAD_POS D1N4371
D6 VAD_NEG VBEM2 D1N4371
C40 +HV 0 220µ
C42 +LV 0 220µ
C43 -LV 0 220µ
C41 -HV 0 220µ
XD30 -RV N015 BZX84C5V1L  ; pins + -
XD31 N027 +RV BZX84C5V1L  ; pins + -
XRV1 N038 N037 -RV Rtot=10k wiper={DP2correction}
XRV2 N001 N002 +RV Rtot=10k wiper={DP1correction}
C7 feedback N009 {CComp4}
VPHV +HV 0 {PHV}
VPLV +LV 0 {PLV}
VNHV -HV 0 {NHV}
VNLV -LV 0 {NLV}
VPRV +RV 0 {PRV}
VNRV -RV 0 {NRV}
V1 VAS_P_i BUFF_P_o {Vpol1}
V2 BUFF_N_o VAS_N_i {Vpol1}
V3 N003 0 37
V4 NC_01 0 -37
R12 +HV VAS_P_i {Rpol1}
R15 VAS_N_i -HV {Rpol1}
.model D D
.lib standard.dio
.model NPN NPN
.model PNP PNP
.lib standard.bjt
* .tran 0 6m 1m 0.0001m
.param freq 1k
.op
.fourier {freq} 30 -1 V(out)
.lib 2SA1302.lib
.lib 2SC3281.lib
.lib D1N4371.lib
.lib MBR1645.lib
.lib MJE340.lib
.lib MJE350.lib
.lib D1N4148.lib
.lib MPSA42.lib
.lib MPSA92.lib
.lib D1N969.lib
* .ac dec 10000 0.01 10G
.param VPin=1
.lib BZX84C5V1.lib
.lib MMBTA42.lib
.lib MMBTA92.lib
.lib MMPQ6700.lib
.option plotwinsize=0
.meas TRAN Vrms RMS V(out)
.meas TRAN Pout PARAM (Vrms*Vrms/{RL})
.option numdgt=9
.meas TRAN Vout_max MAX V(out)
.param RL=8
.meas TRAN PinPHV AVG (V(+HV)*-I(VPHV))
.meas TRAN PinPLV AVG (V(+LV)*-I(VPLV))
.meas TRAN PinNHV AVG (V(-HV)*-I(VNHV))
.meas TRAN PinNLV AVG (V(-LV)*-I(VNLV))
.meas TRAN Pin param (PinPHV + PinPLV + PinNHV + PinNLV )
.meas TRAN Eff PARAM (Pout / Pin)
.param Rpol1=1.2k
.param Rpol2=249
.param Rpol3=1.2k
* Estos valores de resistores de polarización, son críticos para
* máxima excursión, máxima potencia y la estabilidad, también
* influyen en el THD, deberíamos evaluar si es conveniente
* que sean presets.
.param CComp1=10n
.param CComp2N=100p
.param CComp3=120p
* Compensación
.param CComp2P=68p
.param CComp4=2.7p
.param PHV={HV} PLV={LV} NHV=-{HV} NLV=-{LV} PRV={RV} NRV=-{RV}
.param HV=37
.param LV=16
.param RV=15
.param DP1correction=0.5
.param DP2correction=0.5
.param Vpol1=22
.lib 2SC5200.mod
.lib 2SA1943.mod
.backanno
.end